# EAGLE design Servo12Controller (EAGLE 9.6.2)
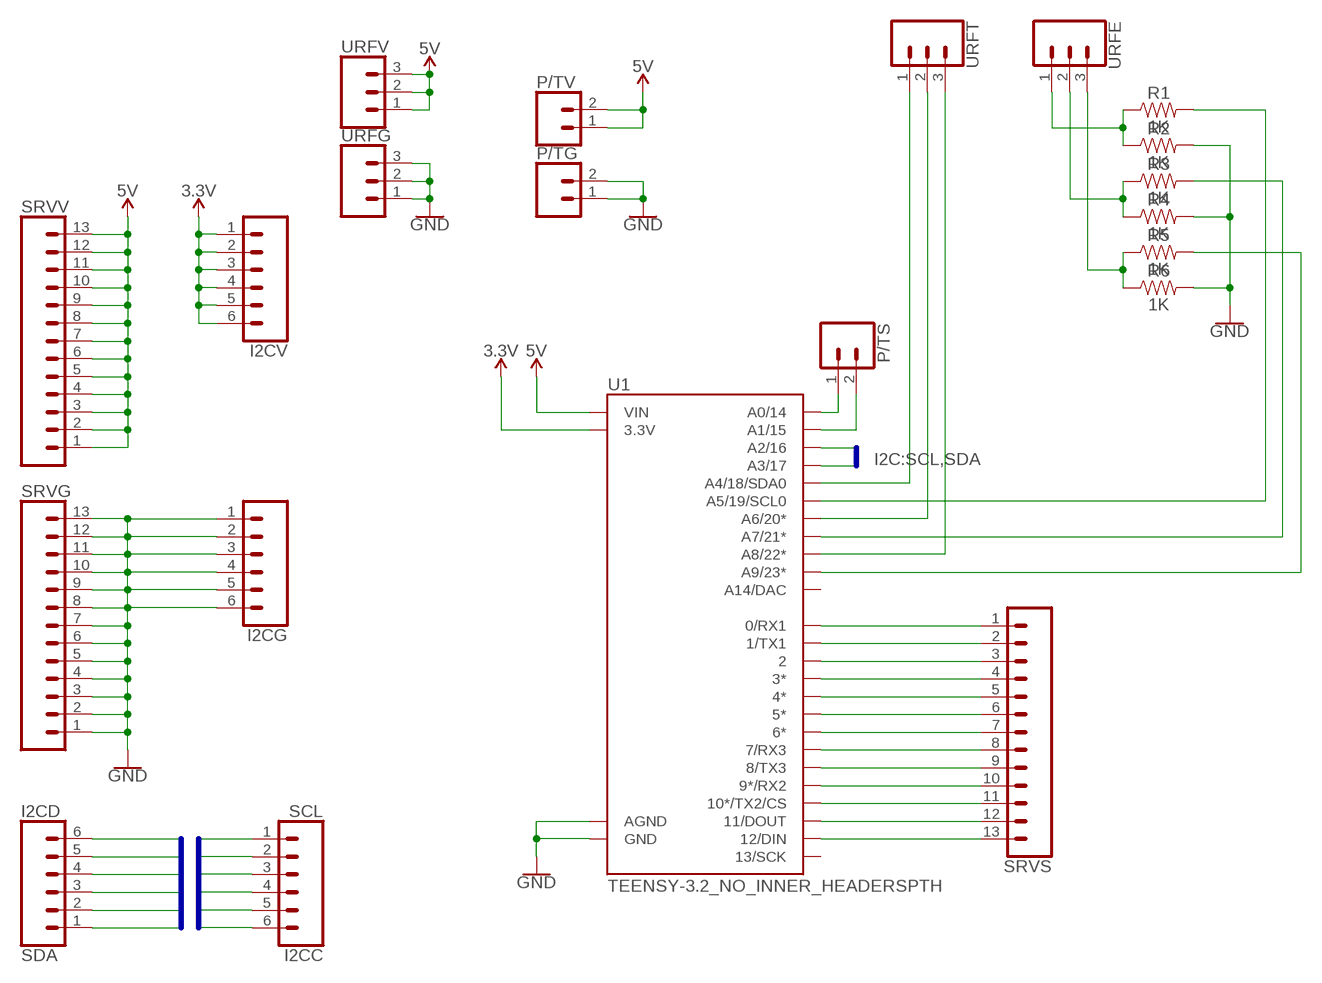
[diagram p0: schematic, sheet 1]

## Parts
I2CC  SCL  CONN_06LOCK  [1X06_LOCK]
I2CD  SDA  CONN_06LOCK  [1X06_LOCK]
I2CG  CONN_06LOCK  [1X06_LOCK]
I2CV  CONN_06LOCK  [1X06_LOCK]
P/TG  CONN_02LOCK  [1X02_LOCK]
P/TS  CONN_02LOCK  [1X02_LOCK]
P/TV  CONN_02LOCK  [1X02_LOCK]
R1  1K  RESISTORAXIAL-0.3  [AXIAL-0.3]
R2  1K  RESISTORAXIAL-0.3  [AXIAL-0.3]
R3  1K  RESISTORAXIAL-0.3  [AXIAL-0.3]
R4  1K  RESISTORAXIAL-0.3  [AXIAL-0.3]
R5  1K  RESISTORAXIAL-0.3  [AXIAL-0.3]
R6  1K  RESISTORAXIAL-0.3  [AXIAL-0.3]
SRVG  CONN_13LOCK  [1X13_LOCK]
SRVS  CONN_13LOCK  [1X13_LOCK]
SRVV  CONN_13LOCK  [1X13_LOCK]
U1  TEENSY-3.2_NO_INNER_HEADERSPTH  [TEENSY_TEENSY-3.2-PTH]
URFE  CONN_03LOCK  [1X03_LOCK]
URFG  CONN_03LOCK  [1X03_LOCK]
URFT  CONN_03LOCK  [1X03_LOCK]
URFV  CONN_03LOCK  [1X03_LOCK]

## Nets
3.3V: I2CV.1 I2CV.2 I2CV.3 I2CV.4 I2CV.5 I2CV.6 U1.3.3V U1.3.3V-1(3.3V)
5V: P/TV.1 P/TV.2 SRVV.1 SRVV.2 SRVV.3 SRVV.4 SRVV.5 SRVV.6 SRVV.7 SRVV.8 SRVV.9 SRVV.10 SRVV.11 SRVV.12 SRVV.13 U1.VIN URFV.1 URFV.2 URFV.3
GND: I2CG.1 I2CG.2 I2CG.3 I2CG.4 I2CG.5 I2CG.6 P/TG.1 P/TG.2 R2.P$2 R4.P$2 R6.P$2 SRVG.1 SRVG.2 SRVG.3 SRVG.4 SRVG.5 SRVG.6 SRVG.7 SRVG.8 SRVG.9 SRVG.10 SRVG.11 SRVG.12 SRVG.13 U1.AGND U1.GND U1.GND1(GND) URFG.1 URFG.2 URFG.3
N$1: SRVS.1 U1.0(0/RX1)
N$2: SRVS.2 U1.1(1/TX1)
N$3: SRVS.3 U1.2
N$4: SRVS.4 U1.3(3*)
N$5: SRVS.5 U1.4(4*)
N$6: SRVS.6 U1.5(5*)
N$7: SRVS.7 U1.6(6*)
N$8: SRVS.8 U1.7(7/RX3)
N$9: SRVS.9 U1.8(8/TX3)
N$10: SRVS.10 U1.9(9*/RX2)
N$11: SRVS.11 U1.10(10*/TX2/CS)
N$12: SRVS.12 U1.11(11/DOUT)
N$13: SRVS.13 U1.12(12/DIN)
N$14: U1.18(A4/18/SDA0) URFT.1
N$15: U1.20(A6/20*) URFT.2
N$16: U1.22(A8/22*) URFT.3
N$17: R1.P$2 U1.19(A5/19/SCL0)
N$18: R3.P$2 U1.21(A7/21*)
N$19: R5.P$2 U1.23(A9/23*)
N$20: P/TS.1 U1.14(A0/14)
N$21: P/TS.2 U1.15(A1/15)
N$25: R1.P$1 R2.P$1 URFE.1
N$26: R3.P$1 R4.P$1 URFE.2
N$27: R5.P$1 R6.P$1 URFE.3
SCL: I2CC.1 I2CC.2 I2CC.3 I2CC.4 I2CC.5 I2CC.6 U1.16(A2/16)
SDA: I2CD.1 I2CD.2 I2CD.3 I2CD.4 I2CD.5 I2CD.6 U1.17(A3/17)
Unconnected: U1.13(13/SCK) U1.A14/DAC

## Buses
I2C:SCL,SDA
SCL,SDA

## Library data of the parts
I2CC I2CD I2CG I2CV = SparkFun-Connectors:CONN_06: Multi connection point. Often used as Generic Header-pin footprint for 0.1 inch spaced/style header connections On any of the 0.1 inch spaced packages, you can populate with these: Break Away Headers - Straight <https://www.sparkfun.com/products/116> (PRT-00116) Break Away Male Headers - Right Angle <https://www.sparkfun.com/products/553> (PRT-00553) Female Headers <https://www.sparkfun.com/products/115> (PRT-00115) Break Away Headers - Machine Pin <https://www.sparkfun.com/products/117> (PRT-00117) Break Away Female Headers - Swiss Machine Pin <https://www.sparkfun.com/products/743> (PRT-00743) Arduino Stackable Header - 6 Pin <https://www.sparkfun.com/products/9280> (PRT-09280) For SCREWTERMINALS and SPRING TERMINALS visit here: Screw Terimnals on SparkFun.com <https://www.sparkfun.com/search/results?term=Screw+Terminals> (5mm/3.5mm/2.54mm spacing) This device is also useful as a general connection point to wire up your design to another part of your project. Our various solder wires solder well into these plated through hole pads. Hook-Up Wire - Assortment (Stranded, 22 AWG) <https://www.sparkfun.com/products/11375> (PRT-11375) Hook-Up Wire - Assortment (Solid Core, 22 AWG) <https://www.sparkfun.com/products/11367> (PRT-11367) View the entire wire category on our website here <https://www.sparkfun.com/categories/141>
P/TG P/TS P/TV = SparkFun-Connectors:CONN_02: Multi connection point. Often used as Generic Header-pin footprint for 0.1 inch spaced/style header connections On any of the 0.1 inch spaced packages, you can populate with these: Break Away Headers - Straight <https://www.sparkfun.com/products/116> (PRT-00116) Break Away Male Headers - Right Angle <https://www.sparkfun.com/products/553> (PRT-00553) Female Headers <https://www.sparkfun.com/products/115> (PRT-00115) Break Away Headers - Machine Pin <https://www.sparkfun.com/products/117> (PRT-00117) Break Away Female Headers - Swiss Machine Pin <https://www.sparkfun.com/products/743> (PRT-00743) For SCREWTERMINALS and SPRING TERMINALS visit here: Screw Terimnals on SparkFun.com <https://www.sparkfun.com/search/results?term=Screw+Terminals> (5mm/3.5mm/2.54mm spacing) This device is also useful as a general connection point to wire up your design to another part of your project. Our various solder wires solder well into these plated through hole pads. Hook-Up Wire - Assortment (Stranded, 22 AWG) <https://www.sparkfun.com/products/11375> (PRT-11375) Hook-Up Wire - Assortment (Solid Core, 22 AWG) <https://www.sparkfun.com/products/11367> (PRT-11367) View the entire wire category on our website here <https://www.sparkfun.com/categories/141> Special notes: Molex polarized connector foot print use with: PRT-08233 with associated crimp pins and housings. 2.54_SCREWTERM for use with PRT-10571. 3.5mm Screw Terminal footprints for PRT-08084 5mm Screw Terminal footprints for use with PRT-08432
R1-R6 = SparkFun-Resistors:RESISTOR: Generic Resistor Package
SRVG SRVS SRVV = SparkFun-Connectors:CONN_13: Multi connection point. Often used as Generic Header-pin footprint for 0.1 inch spaced/style header connections On any of the 0.1 inch spaced packages, you can populate with these: Break Away Headers - Straight <https://www.sparkfun.com/products/116> (PRT-00116) Break Away Male Headers - Right Angle <https://www.sparkfun.com/products/553> (PRT-00553) Female Headers <https://www.sparkfun.com/products/115> (PRT-00115) Break Away Headers - Machine Pin <https://www.sparkfun.com/products/117> (PRT-00117) Break Away Female Headers - Swiss Machine Pin <https://www.sparkfun.com/products/743> (PRT-00743) For SCREWTERMINALS and SPRING TERMINALS visit here: Screw Terimnals on SparkFun.com <https://www.sparkfun.com/search/results?term=Screw+Terminals> (5mm/3.5mm/2.54mm spacing) This device is also useful as a general connection point to wire up your design to another part of your project. Our various solder wires solder well into these plated through hole pads. Hook-Up Wire - Assortment (Stranded, 22 AWG) <https://www.sparkfun.com/products/11375> (PRT-11375) Hook-Up Wire - Assortment (Solid Core, 22 AWG) <https://www.sparkfun.com/products/11367> (PRT-11367) View the entire wire category on our website here <https://www.sparkfun.com/categories/141> Special notes: Molex polarized connector foot print use with SKU : PRT-08231 with associated crimp pins and housings. 1MM SMD Version SKU: PRT-10208 NOTES ON THE VARIANTS LOCK and LOCK_LONGPADS... This footprint was designed to help hold the alignment of a through-hole component (i.e. 6-pin header) while soldering it into place. You may notice that each hole has been shifted either up or down by 0.005 of an inch from it's more standard position (which is a perfectly straight line). This slight alteration caused the pins (the squares in the middle) to touch the edges of the holes. Because they are alternating, it causes a "brace" to hold the component in place. 0.005 has proven to be the perfect amount of "off-center" position when using our standard breakaway headers. Although looks a little odd when you look at the bare footprint, once you have a header in there, the alteration is very hard to notice. Also,if you push a header all the way into place, it is covered up entirely on the bottom side.
U1 = SparkFun-Boards:TEENSY-3.2_NO_INNER_HEADERS
URFE URFG URFT URFV = SparkFun-Connectors:CONN_03: Multi connection point. Often used as Generic Header-pin footprint for 0.1 inch spaced/style header connections On any of the 0.1 inch spaced packages, you can populate with these: Break Away Headers - Straight <https://www.sparkfun.com/products/116> (PRT-00116) Break Away Male Headers - Right Angle <https://www.sparkfun.com/products/553> (PRT-00553) Female Headers <https://www.sparkfun.com/products/115> (PRT-00115) Break Away Headers - Machine Pin <https://www.sparkfun.com/products/117> (PRT-00117) Break Away Female Headers - Swiss Machine Pin <https://www.sparkfun.com/products/743> (PRT-00743) Stackable Header - 3 Pin (Female, 0.1") <https://www.sparkfun.com/products/13875> (PRT-13875) For SCREWTERMINALS and SPRING TERMINALS visit here: Screw Terimnals on SparkFun.com <https://www.sparkfun.com/search/results?term=Screw+Terminals> (5mm/3.5mm/2.54mm spacing) This device is also useful as a general connection point to wire up your design to another part of your project. Our various solder wires solder well into these plated through hole pads. Hook-Up Wire - Assortment (Stranded, 22 AWG) <https://www.sparkfun.com/products/11375> (PRT-11375) Hook-Up Wire - Assortment (Solid Core, 22 AWG) <https://www.sparkfun.com/products/11367> (PRT-11367) View the entire wire category on our website here <https://www.sparkfun.com/categories/141> Special notes: Molex polarized connector foot print use with SKU : PRT-08232 with associated crimp pins and housings.

## Board
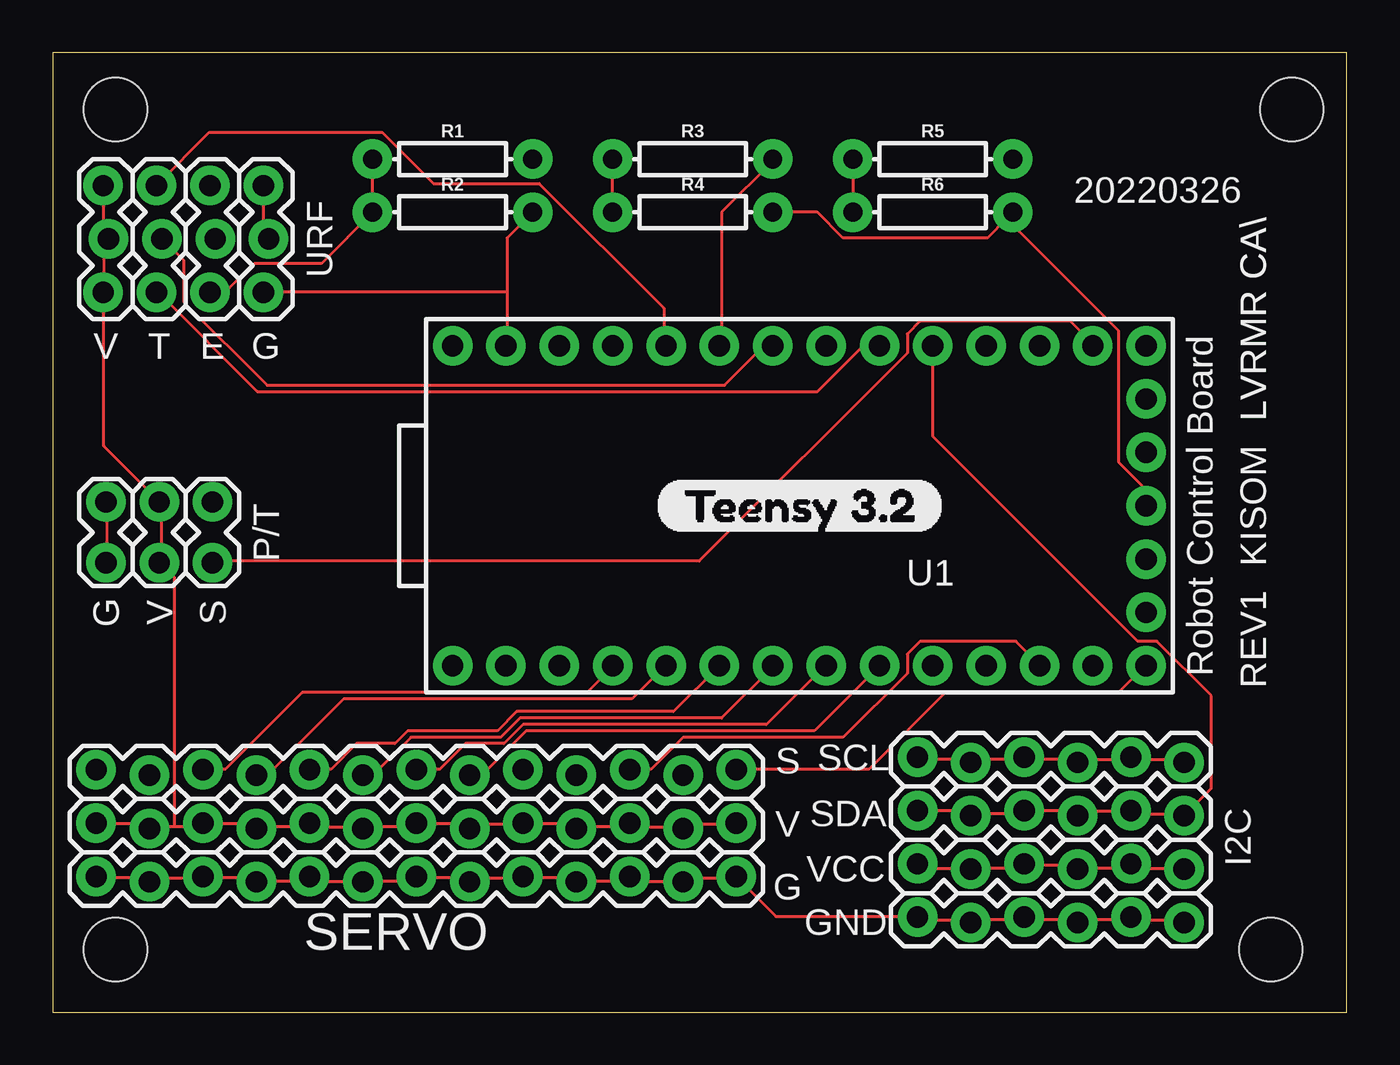
[diagram p1: board, top side]
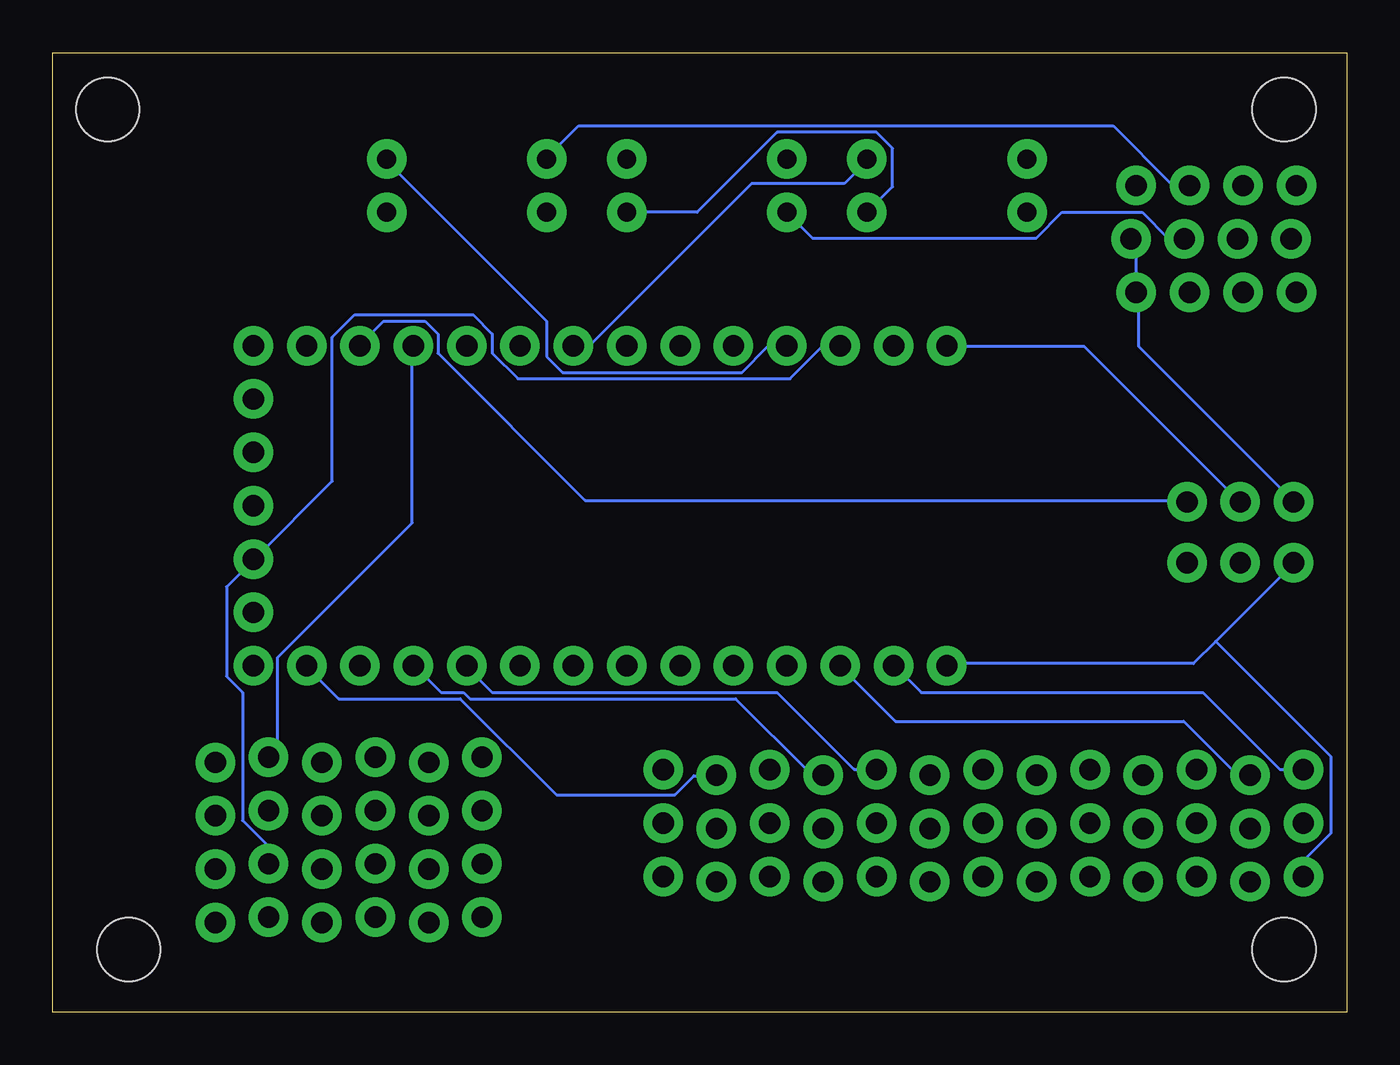
[diagram p2: board, bottom side, seen from below]

Size 61.63 x 45.71 mm. Coordinates in mm from the lower left corner, seen from the top.
Outline: 0,0 61.63,0 61.63,45.71 0,45.71 0,0
Copper layers (1*16): Top 0.035559375mm / dielectric 1.6mm / Bottom 0.035559375mm
Design rules "oshpark-2layer": minimum track width 6mil, minimum drill 10mil, track to track 6mil, track to pad 6mil, pad to pad 6mil, via to via 6mil, smd to smd 6mil, copper to edge 15mil, drill to drill 6mil, minimum pad ring 5mil, minimum via ring 5mil, stop-mask expansion 2.5mil, vias tented up to drill 0mil, thermal gap 10mil
Holes 3 mm at 3,3 3,43 59,43 58,3

### Footprints (pad centres in the part's own frame; a part is rotated, then mirrored left to right if it is on the bottom)
1X06_LOCK = drill 1.016 pad 1.88: 1 0,0; 2 2.54,-0.254; 3 5.08,0; 4 7.62,-0.254; 5 10.16,0; 6 12.7,-0.254
1X02_LOCK = drill 1.016 pad 1.88: 1 -0.178,0; 2 2.718,0
AXIAL-0.3 = drill 0.9 pad 1.88: P$1 -3.81,0; P$2 3.81,0
1X13_LOCK = drill 1.016 pad 1.88: 1 0,0.127; 2 2.54,-0.127; 3 5.08,0.127; 4 7.62,-0.127; 5 10.16,0.127; 6 12.7,-0.127; 7 15.24,0.127; 8 17.78,-0.127; 9 20.32,0.127; 10 22.86,-0.127; 11 25.4,0.127; 12 27.94,-0.127; 13 30.48,0.127
TEENSY_TEENSY-3.2-PTH = drill 1.016 pad 1.88: 0 -13.97,-7.62; 1 -11.43,-7.62; 2 -8.89,-7.62; 3 -6.35,-7.62; 3.3V 16.51,-2.54; 3.3V-1 -11.43,7.62; 4 -3.81,-7.62; 5 -1.27,-7.62; 6 1.27,-7.62; 7 3.81,-7.62; 8 6.35,-7.62; 9 8.89,-7.62; 10 11.43,-7.62; 11 13.97,-7.62; 12 16.51,-7.62; 13 16.51,7.62; 14 13.97,7.62; 15 11.43,7.62; 16 8.89,7.62; 17 6.35,7.62; 18 3.81,7.62; 19 1.27,7.62; 20 -1.27,7.62; 21 -3.81,7.62; 22 -6.35,7.62; 23 -8.89,7.62; A14/DAC 16.51,5.08; AGND -13.97,7.62; GND 16.51,0; GND1 -16.51,-7.62; PROG 16.51,2.54; VBAT 16.51,-5.08; VIN -16.51,7.62
1X03_LOCK = drill 1.016 pad 1.88: 1 0,0.127; 2 2.54,-0.127; 3 5.08,0.127

### Placement (x,y rotation side)
I2CC  41.18,12.16 0 top
I2CD  41.18,9.62 0 top
I2CG  41.18,4.54 0 top
I2CV  41.18,7.08 0 top
P/TG  2.54,21.59 90 top
P/TS  7.62,21.59 90 top
P/TV  5.08,21.59 90 top
R1  19.05,40.64 0 top
R2  19.05,38.1 0 top
R3  30.48,40.64 0 top
R4  30.48,38.1 0 top
R5  41.91,40.64 0 top
R6  41.91,38.1 0 top
SRVG  2.08,6.35 0 top
SRVS  2.08,11.43 0 top
SRVV  2.08,8.89 0 top
U1  35.56,24.13 0 top
URFE  7.62,34.29 90 top
URFG  10.16,34.29 90 top
URFT  5.08,34.29 90 top
URFV  2.54,34.29 90 top

### Tracks (layer width: path | path; a pad name or v marks a point on that pad's centre or on a via)
3.3V
  Top 0.152: I2CV.1 41.3,7.01 41.45,6.86 43.59,6.86 I2CV.2 43.74,6.86 46.02,6.86 46.18,7.01 I2CV.3 46.33,7.01 48.62,7.01 I2CV.4 48.92,6.86 51.05,6.86 51.21,7.01 I2CV.5 51.36,7.01 51.51,6.86 53.8,6.86 I2CV.6
  Bottom 0.152: U1.3.3V-1 24.23,31.7 24.99,31.7 26.52,30.18 39.47,30.18 40.69,31.39 40.69,32.31 41.6,33.22 47.24,33.22 48.31,32.16 48.31,25.3 51.97,21.64 U1.3.3V 52.12,21.49 53.34,20.27 53.34,16 52.58,15.24 52.58,9.14 51.36,7.92 51.36,7.16 I2CV.5
5V
  Top 0.152: 5.79,8.84 6.86,8.84 7.01,8.99 SRVV.3 7.16,8.99 9.45,8.99 9.6,8.84 SRVV.4 9.75,8.84 12.04,8.84 12.19,8.99 SRVV.5 12.34,8.99 12.5,8.84 14.63,8.84 SRVV.6 14.78,8.84 17.07,8.84 17.22,8.99 SRVV.7 17.37,8.99 19.66,8.99 19.81,8.84 SRVV.8 19.96,8.84 20.12,8.99 22.25,8.99 SRVV.9 22.4,8.99 24.69,8.99 24.84,8.84 SRVV.10 24.99,8.84 27.28,8.84 27.43,8.99 SRVV.11 27.58,8.99 27.74,8.84 29.87,8.84 SRVV.12 30.02,8.84 30.18,8.99 32.46,8.99 SRVV.13 | 5.79,8.84 4.72,8.84 SRVV.2 4.57,8.84 4.42,8.99 2.13,8.99 SRVV.1 | 2.44,34.29 2.44,36.58 2.59,36.73 URFV.2 2.59,36.88 2.44,37.03 2.44,39.32 URFV.3 | 2.44,34.29 2.44,26.98 5.03,24.38 P/TV.2 5.18,24.23 5.18,21.49 P/TV.1 5.18,21.34 5.79,20.73 5.79,8.84 | 2.44,34.29 URFV.1
  Bottom 0.152: U1.VIN 19.05,31.7 12.5,31.7 5.18,24.38 P/TV.2
GND
  Top 0.152: SRVG.1 2.13,6.4 4.42,6.4 4.57,6.25 SRVG.2 4.72,6.25 4.88,6.4 7.01,6.4 SRVG.3 7.16,6.4 9.45,6.4 9.6,6.25 SRVG.4 9.75,6.25 12.04,6.25 12.19,6.4 SRVG.5 12.34,6.4 12.5,6.25 14.63,6.25 SRVG.6 14.78,6.25 17.07,6.25 17.22,6.4 SRVG.7 17.37,6.4 19.66,6.4 19.81,6.25 SRVG.8 19.96,6.25 20.12,6.4 22.25,6.4 SRVG.9 22.4,6.4 24.69,6.4 24.84,6.25 SRVG.10 24.99,6.25 27.28,6.25 27.43,6.4 SRVG.11 27.58,6.4 27.74,6.25 29.87,6.25 SRVG.12 30.02,6.25 30.18,6.4 32.46,6.4 SRVG.13 32.61,6.4 34.44,4.57 41.15,4.57 I2CG.1 41.3,4.42 43.59,4.42 I2CG.2 43.74,4.42 46.18,4.42 I2CG.3 46.33,4.42 48.77,4.42 I2CG.4 48.92,4.42 51.21,4.42 I2CG.5 51.36,4.42 53.8,4.42 I2CG.6 | R4.P$2 36.42,38.1 37.64,36.88 44.5,36.88 45.41,37.8 | 45.41,37.8 50.75,32.46 50.75,26.21 51.97,24.99 51.97,24.23 U1.GND | 45.41,37.8 R6.P$2 | URFG.3 10.06,39.32 10.06,37.03 10.21,36.88 URFG.2 | 21.64,34.29 21.64,36.88 R2.P$2 | 21.64,34.29 21.64,31.85 U1.AGND | 21.64,34.29 URFG.1 | P/TG.1 2.59,21.49 2.59,24.23 P/TG.2
  Bottom 0.152: URFG.2 10.21,36.73 10.06,36.58 10.06,34.29 URFG.1 9.91,34.29 9.91,31.7 2.59,24.38 P/TG.2 | 6.25,17.68 2.59,21.34 P/TG.1 | 6.25,17.68 7.32,16.61 19.05,16.61 U1.GND1 | R4.P$2 30.94,38.1 27.13,41.91 22.4,41.91 21.64,41.15 21.64,39.32 R2.P$2 | 6.25,17.68 0.76,12.19 0.76,8.53 1.98,7.32 1.98,6.55 SRVG.1
N$1
  Bottom 0.152: SRVS.1 2.13,11.58 3.2,11.58 6.86,15.24 20.27,15.24 21.49,16.46 U1.0
N$2
  Bottom 0.152: U1.1 21.49,13.87 7.77,13.87 5.33,11.43 4.72,11.43 SRVS.2
N$3
  Top 0.152: SRVS.3 7.16,11.58 8.23,11.58 11.89,15.24 25.45,15.24 26.67,16.46 U1.2
N$4
  Top 0.152: SRVS.4 9.75,11.43 10.36,11.43 13.87,14.94 27.58,14.94 29.11,16.46 U1.3
N$5
  Top 0.152: U1.4 29.57,14.33 22.1,14.33 21.18,13.41 16.92,13.41 16.31,12.8 14.48,12.8 13.26,11.58 12.34,11.58 SRVS.5
N$6
  Top 0.152: SRVS.6 14.78,11.43 15.39,11.43 17.07,13.11 21.34,13.11 22.25,14.02 31.85,14.02 34.29,16.46 U1.5
N$7
  Top 0.152: SRVS.7 17.37,11.58 18.44,11.58 19.66,12.8 21.49,12.8 22.4,13.72 33.98,13.72 36.73,16.46 U1.6
N$8
  Top 0.152: U1.7 36.27,13.41 22.55,13.41 20.57,11.43 19.96,11.43 SRVS.8
N$9
  Bottom 0.152: SRVS.9 22.4,11.58 23.47,11.58 27.13,15.24 40.69,15.24 41.91,16.46 U1.8
N$10
  Bottom 0.152: SRVS.10 24.99,11.43 25.6,11.43 29.11,14.94 41.76,14.94 42.06,15.24 43.13,15.24 44.35,16.46 U1.9
N$11
  Top 0.152: SRVS.11 27.58,11.58 28.5,11.58 30.02,13.11 37.64,13.11 40.69,16.15 40.69,17.07 41.3,17.68 45.87,17.68 46.94,16.61 U1.10
N$12
  Bottom 0.152: SRVS.12 30.02,11.28 31.09,11.28 32,10.36 37.64,10.36 42.22,14.94 48.01,14.94 49.53,16.46 U1.11
N$13
  Top 0.152: SRVS.13 32.61,11.58 38.86,11.58 42.52,15.24 50.75,15.24 51.97,16.46 U1.12
N$14
  Top 0.152: U1.18 39.32,31.7 38.56,31.7 36.42,29.57 9.75,29.57 5.03,34.29 URFT.1
N$15
  Top 0.152: U1.20 34.29,31.7 33.83,31.7 32,29.87 10.21,29.87 6.25,33.83 6.25,35.81 5.33,36.73 URFT.2
N$16
  Top 0.152: U1.22 29.11,31.85 29.11,33.53 23.16,39.47 18.14,39.47 15.7,41.91 7.47,41.91 5.03,39.47 URFT.3
N$17
  Bottom 0.152: U1.19 36.73,31.85 35.97,31.85 28.35,39.47 23.93,39.47 22.86,40.54 R1.P$2
N$18
  Top 0.152: U1.21 31.85,31.85 31.85,38.1 34.29,40.54 R3.P$2
N$19
  Bottom 0.152: U1.23 26.67,31.7 27.58,31.7 28.8,30.48 37.34,30.48 38.1,31.24 38.1,32.92 45.72,40.54 R5.P$2
N$20
  Top 0.152: P/TS.1 7.62,21.49 30.79,21.49 40.69,31.39 40.69,32.31 41.3,32.92 48.46,32.92 49.53,31.85 U1.14
N$21
  Bottom 0.152: P/TS.2 7.62,24.38 36.27,24.38 43.28,31.39 43.28,32.31 43.89,32.92 45.87,32.92 46.94,31.85 U1.15
N$25
  Top 0.152: URFE.1 8.23,34.29 9.6,35.66 12.8,35.66 R2.P$1 R1.P$1
N$26
  Top 0.152: R4.P$1 R3.P$1
  Bottom 0.152: R4.P$1 25.45,36.88 14.78,36.88 13.56,38.1 9.75,38.1 8.53,36.88 7.77,36.88 URFE.2
N$27
  Top 0.152: R5.P$1 R6.P$1
  Bottom 0.152: URFE.3 7.62,39.47 8.38,39.47 11.12,42.22 36.58,42.22 38.1,40.69 R5.P$1
SCL
  Top 0.152: I2CC.1 41.3,12.04 43.59,12.04 I2CC.2 43.74,12.04 46.18,12.04 I2CC.3 46.33,12.04 48.77,12.04 I2CC.4 48.92,12.04 51.21,12.04 I2CC.5 51.36,12.04 53.8,12.04 I2CC.6
  Bottom 0.152: U1.16 44.5,31.7 44.5,23.32 50.9,16.92 50.9,12.5 51.21,12.19 I2CC.5
SDA
  Top 0.152: I2CD.1 41.3,9.6 43.43,9.6 43.59,9.45 I2CD.2 43.74,9.45 46.02,9.45 46.18,9.6 I2CD.3 46.33,9.6 48.62,9.6 48.77,9.45 I2CD.4 48.92,9.45 49.07,9.6 51.21,9.6 I2CD.5 51.51,9.45 53.8,9.45 I2CD.6 53.95,9.45 55.17,10.67 55.17,15.09 52.58,17.68 51.66,17.68 41.91,27.43 U1.17

### Text on the board
tPlace: 20220326 | URF | LVRMR CA\ | LVRMR CA\ | V | T | E | G | Robot Control Board | KISOM | P/T | G | V | S | REV1 | S | SCL | V | SDA | I2C | VCC | G | GND | SERVO